# Altium project QUTMS_Shutdownboard_V2_1_Mezzanine.PrjPcb
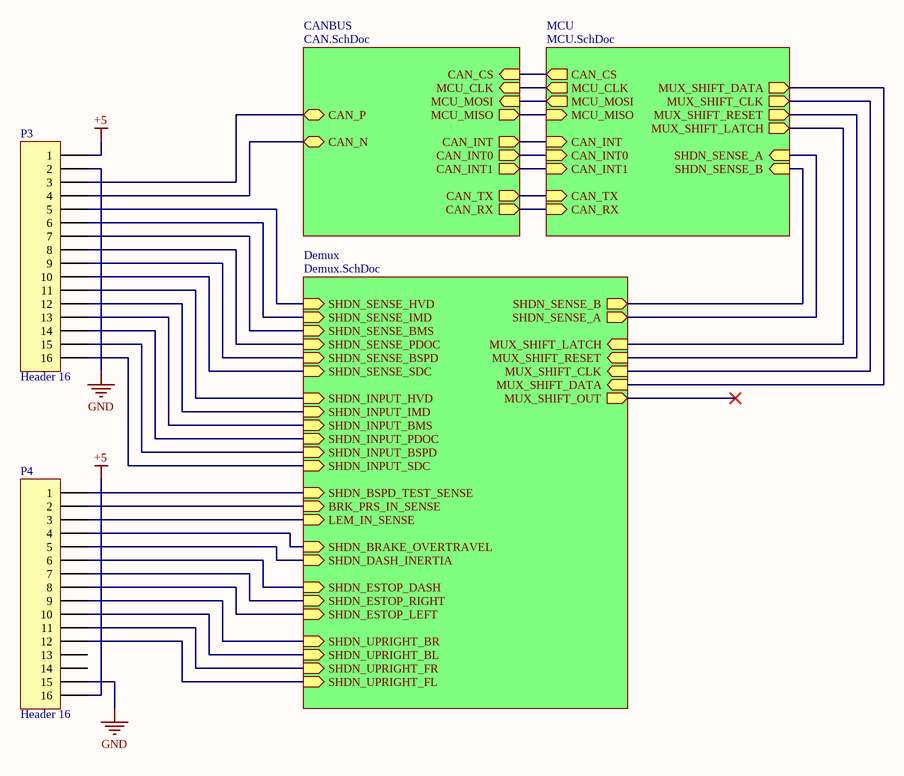
[diagram p0: Master.SchDoc]
4 sheets, 103 parts. Net scope: hierarchical (ports join the sheet entries above them; power ports are global).
Board file: DeutschPCB.PcbDoc
Sheets:
  Master.SchDoc
    MCU = MCU.SchDoc
    CANBUS = CAN.SchDoc
    Demux = Demux.SchDoc

## Sheet Master.SchDoc: QUTMS Shutdown Board V2.1 - Master Top
size A4; DocumentNumber: 1; Revision: 4; SheetNumber: 1; SheetTotal: 4

### Parts
P3  Header 16  [HDR1X16]
P4  Header 16  [HDR1X16]

### Sub-sheets
CANBUS = CAN.SchDoc: MCU_MOSI (in), MCU_CLK (in), CAN_CS (in), MCU_MISO (out), CAN_N (bidir), CAN_P (bidir), CAN_INT1 (out), CAN_INT0 (out), CAN_INT (out), CAN_TX (out), CAN_RX (out)
Demux = Demux.SchDoc: SHDN_ESTOP_DASH (in), SHDN_UPRIGHT_BL (in), SHDN_UPRIGHT_BR (in), SHDN_ESTOP_LEFT (in), SHDN_ESTOP_RIGHT (in), SHDN_DASH_INERTIA (in), SHDN_UPRIGHT_FR (in), SHDN_UPRIGHT_FL (in), SHDN_BRAKE_OVERTRAVEL (in), SHDN_BSPD_TEST_SENSE (in), BRK_PRS_IN_SENSE (in), LEM_IN_SENSE (in), SHDN_INPUT_HVD (in), SHDN_INPUT_IMD (in), SHDN_INPUT_BMS (in), SHDN_INPUT_PDOC (in), SHDN_INPUT_BSPD (in), SHDN_SENSE_HVD (in), SHDN_SENSE_IMD (in), SHDN_SENSE_BMS (in), SHDN_SENSE_PDOC (in), SHDN_SENSE_BSPD (in), SHDN_SENSE_A (out), MUX_SHIFT_OUT (out), SHDN_SENSE_B (out), MUX_SHIFT_LATCH (in), MUX_SHIFT_RESET (in), MUX_SHIFT_CLK (in), MUX_SHIFT_DATA (in), SHDN_INPUT_SDC (in), SHDN_SENSE_SDC (in)
MCU = MCU.SchDoc: MCU_MISO (in), MCU_MOSI (out), CAN_CS (out), MCU_CLK (out), CAN_INT (in), CAN_INT0 (in), CAN_INT1 (in), SHDN_SENSE_B (in), SHDN_SENSE_A (in), MUX_SHIFT_LATCH (out), MUX_SHIFT_RESET (out), MUX_SHIFT_CLK (out), MUX_SHIFT_DATA (out), CAN_RX (in), CAN_TX (in)

### Nets
+5: P3.1 P4.16
GND: P3.2 P4.15
CAN_CS: sheet MCU/CAN_CS, sheet CANBUS/CAN_CS
CAN_INT: sheet MCU/CAN_INT, sheet CANBUS/CAN_INT
CAN_INT0: sheet MCU/CAN_INT0, sheet CANBUS/CAN_INT0
CAN_INT1: sheet MCU/CAN_INT1, sheet CANBUS/CAN_INT1
CAN_N: P3.4 ; sheet CANBUS/CAN_N
CAN_P: P3.3 ; sheet CANBUS/CAN_P
CAN_RX: sheet MCU/CAN_RX, sheet CANBUS/CAN_RX
CAN_TX: sheet MCU/CAN_TX, sheet CANBUS/CAN_TX
MCU_CLK: sheet MCU/MCU_CLK, sheet CANBUS/MCU_CLK
MCU_MISO: sheet MCU/MCU_MISO, sheet CANBUS/MCU_MISO
MCU_MOSI: sheet MCU/MCU_MOSI, sheet CANBUS/MCU_MOSI
MUX_SHIFT_CLK: sheet MCU/MUX_SHIFT_CLK, sheet Demux/MUX_SHIFT_CLK
MUX_SHIFT_DATA: sheet MCU/MUX_SHIFT_DATA, sheet Demux/MUX_SHIFT_DATA
MUX_SHIFT_LATCH: sheet MCU/MUX_SHIFT_LATCH, sheet Demux/MUX_SHIFT_LATCH
MUX_SHIFT_RESET: sheet MCU/MUX_SHIFT_RESET, sheet Demux/MUX_SHIFT_RESET
SHDN_SENSE_A: sheet MCU/SHDN_SENSE_A, sheet Demux/SHDN_SENSE_A
SHDN_SENSE_B: sheet MCU/SHDN_SENSE_B, sheet Demux/SHDN_SENSE_B
NetP3_5: P3.5 ; sheet Demux/SHDN_SENSE_HVD
NetP3_6: P3.6 ; sheet Demux/SHDN_SENSE_IMD
NetP3_7: P3.7 ; sheet Demux/SHDN_SENSE_BMS
NetP3_8: P3.8 ; sheet Demux/SHDN_SENSE_PDOC
NetP3_9: P3.9 ; sheet Demux/SHDN_SENSE_BSPD
NetP3_10: P3.10 ; sheet Demux/SHDN_SENSE_SDC
NetP3_11: P3.11 ; sheet Demux/SHDN_INPUT_HVD
NetP3_12: P3.12 ; sheet Demux/SHDN_INPUT_IMD
NetP3_13: P3.13 ; sheet Demux/SHDN_INPUT_BMS
NetP3_14: P3.14 ; sheet Demux/SHDN_INPUT_PDOC
NetP3_15: P3.15 ; sheet Demux/SHDN_INPUT_BSPD
NetP3_16: P3.16 ; sheet Demux/SHDN_INPUT_SDC
NetP4_1: P4.1 ; sheet Demux/SHDN_BSPD_TEST_SENSE
NetP4_2: P4.2 ; sheet Demux/BRK_PRS_IN_SENSE
NetP4_3: P4.3 ; sheet Demux/LEM_IN_SENSE
NetP4_4: P4.4 ; sheet Demux/SHDN_BRAKE_OVERTRAVEL
NetP4_5: P4.5 ; sheet Demux/SHDN_DASH_INERTIA
NetP4_6: P4.6 ; sheet Demux/SHDN_ESTOP_DASH
NetP4_7: P4.7 ; sheet Demux/SHDN_ESTOP_RIGHT
NetP4_8: P4.8 ; sheet Demux/SHDN_ESTOP_LEFT
NetP4_9: P4.9 ; sheet Demux/SHDN_UPRIGHT_BR
NetP4_10: P4.10 ; sheet Demux/SHDN_UPRIGHT_BL
NetP4_11: P4.11 ; sheet Demux/SHDN_UPRIGHT_FR
NetP4_12: P4.12 ; sheet Demux/SHDN_UPRIGHT_FL

Not connected (* = marked no-connect by the designer): P4 13 14

### Notes on the sheet
- Title
- Size:
- A4
- Number:
- Revision:
- QUT Motorsport, O-120
- O Block, QUT Gardens Point
- Date:
- Time:
- Sheet
- of
- Brisbane, QLD, Australia

### Library data of the parts
P3 P4 = Header 16: Header, 16-Pin; LatestRevisionDate: 17-Jul-2002; LatestRevisionNote: Re-released for DXP Platform.; Publisher: Altium Limited

## Sheet MCU.SchDoc: QUTMS Shutdown V2.1 - MCU
size A4; Author: Jonn Dillon; Organization: QUT Motorsport; Address1: O-120; Address2: O Block; Address3: QUT Gardens Point; Address4: Brisbane, 4000; DocumentNumber: 2; Revision: 2; SheetNumber: 2; SheetTotal: 4
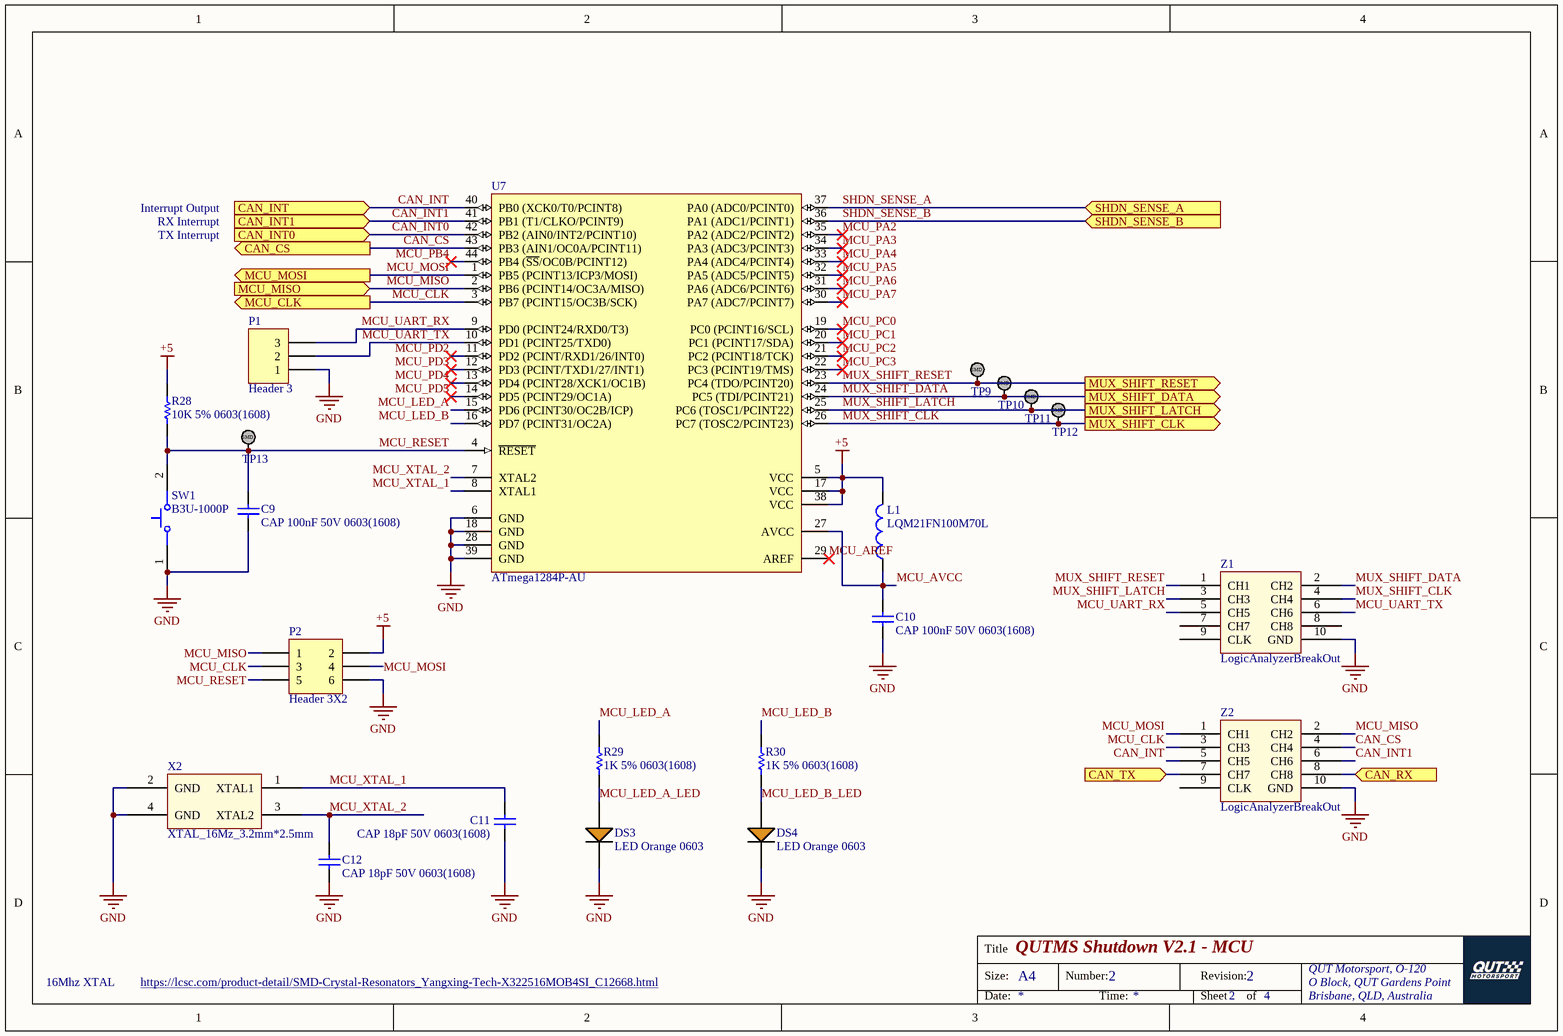
[diagram p1: MCU.SchDoc]

### Parts
C9  CAP 100nF 50V 0603(1608)  [CAPC0603(1608)100_L]
C10  CAP 100nF 50V 0603(1608)  [CAPC0603(1608)100_L]
C11  CAP 18pF 50V 0603(1608)  [CAPC0603(1608)100_L]
C12  CAP 18pF 50V 0603(1608)  [CAPC0603(1608)100_L]
DS3  LED Orange 0603  [LED ORANGE 0603]
DS4  LED Orange 0603  [LED ORANGE 0603]
L1  LQM21FN100M70L  [MURA-IND0805_L]
P1  Header 3  [HDR1X3]
P2  Header 3X2  [HDR2X3]
R28  10K 5% 0603(1608)  [RESC0603(1608)_N]
R29  1K 5% 0603(1608)  [RESC0603(1608)_L]
R30  1K 5% 0603(1608)  [RESC0603(1608)_L]
SW1  B3U-1000P  [OMRON-B3U-1000_V]
TP9  TestPoint_SMD  [TestPointSMD]  (value not drawn)
TP10  TestPoint_SMD  [TestPointSMD]  (value not drawn)
TP11  TestPoint_SMD  [TestPointSMD]  (value not drawn)
TP12  TestPoint_SMD  [TestPointSMD]  (value not drawn)
TP13  TestPoint_SMD  [TestPointSMD]  (value not drawn)
U7  ATmega1284P-AU  [44A_N]
X2  XTAL_16Mz_3.2mm*2.5mm  [3.2mm*2.5mm]
Z1  LogicAnalyzerBreakOut  [LogicAnalyzer]
Z2  LogicAnalyzerBreakOut  [LogicAnalyzer]

### Ports
CAN_CS (out), CAN_INT0 (in), CAN_INT1 (in), CAN_INT (in), CAN_RX (in), CAN_TX (in), MCU_CLK (out), MCU_MISO (in), MCU_MOSI (out), MUX_SHIFT_CLK (out), MUX_SHIFT_DATA (out), MUX_SHIFT_LATCH (out), MUX_SHIFT_RESET (out), SHDN_SENSE_A (in), SHDN_SENSE_B (in)

### Nets
+5: L1.2 P2.2 R28.2 U7.5(VCC) U7.17(VCC) U7.38(VCC)
GND: C9.2 C10.2 C11.1 C12.1 DS3.2(C) DS4.2(C) P1.1 P2.6 SW1.1 U7.6(GND) U7.18(GND) U7.28(GND) U7.39(GND) X2.2(GND) X2.4(GND) Z1.10(GND) Z2.10(GND)
CAN_CS: U7.43(PB3_(AIN1/OC0A/PCINT11)) Z2.4(CH4) ; port CAN_CS
CAN_INT: U7.40(PB0_(XCK0/T0/PCINT8)) Z2.5(CH5) ; port CAN_INT
CAN_INT0: U7.42(PB2_(AIN0/INT2/PCINT10)) ; port CAN_INT0
CAN_INT1: U7.41(PB1_(T1/CLKO/PCINT9)) Z2.6(CH6) ; port CAN_INT1
CAN_RX: Z2.8(CH8) ; port CAN_RX
CAN_TX: Z2.7(CH7) ; port CAN_TX
MCU_AREF: U7.29(AREF)
MCU_AVCC: C10.1 L1.1 U7.27(AVCC)
MCU_CLK: P2.3 U7.3(PB7_(PCINT15/OC3B/SCK)) Z2.3(CH3) ; port MCU_CLK
MCU_LED_A: R29.2 U7.15(PD6_(PCINT30/OC2B/ICP))
MCU_LED_A_LED: DS3.1(A) R29.1
MCU_LED_B: R30.2 U7.16(PD7_(PCINT31/OC2A))
MCU_LED_B_LED: DS4.1(A) R30.1
MCU_MISO: P2.1 U7.2(PB6_(PCINT14/OC3A/MISO)) Z2.2(CH2) ; port MCU_MISO
MCU_MOSI: P2.4 U7.1(PB5_(PCINT13/ICP3/MOSI)) Z2.1(CH1) ; port MCU_MOSI
MCU_PA2: U7.35(PA2_(ADC2/PCINT2))
MCU_PA3: U7.34(PA3_(ADC3/PCINT3))
MCU_PA4: U7.33(PA4_(ADC4/PCINT4))
MCU_PA5: U7.32(PA5_(ADC5/PCINT5))
MCU_PA6: U7.31(PA6_(ADC6/PCINT6))
MCU_PA7: U7.30(PA7_(ADC7/PCINT7))
MCU_PB4: U7.44(PB4_(~{SS}/OC0B/PCINT12))
MCU_PC0: U7.19(PC0_(PCINT16/SCL))
MCU_PC1: U7.20(PC1_(PCINT17/SDA))
MCU_PC2: U7.21(PC2_(PCINT18/TCK))
MCU_PC3: U7.22(PC3_(PCINT19/TMS))
MCU_PD2: U7.11(PD2_(PCINT/RXD1/26/INT0))
MCU_PD3: U7.12(PD3_(PCINT/TXD1/27/INT1))
MCU_PD4: U7.13(PD4_(PCINT28/XCK1/OC1B))
MCU_PD5: U7.14(PD5_(PCINT29/OC1A))
MCU_RESET: C9.1 P2.5 R28.1 SW1.2 TP13.1 U7.4(~{RESET})
MCU_UART_RX: P1.3 U7.9(PD0_(PCINT24/RXD0/T3)) Z1.5(CH5)
MCU_UART_TX: P1.2 U7.10(PD1_(PCINT25/TXD0)) Z1.6(CH6)
MCU_XTAL_1: C11.2 U7.8(XTAL1) X2.1(XTAL1)
MCU_XTAL_2: C12.2 U7.7(XTAL2) X2.3(XTAL2)
MUX_SHIFT_CLK: TP12.1 U7.26(PC7_(TOSC2/PCINT23)) Z1.4(CH4) ; port MUX_SHIFT_CLK
MUX_SHIFT_DATA: TP10.1 U7.24(PC5_(TDI/PCINT21)) Z1.2(CH2) ; port MUX_SHIFT_DATA
MUX_SHIFT_LATCH: TP11.1 U7.25(PC6_(TOSC1/PCINT22)) Z1.3(CH3) ; port MUX_SHIFT_LATCH
MUX_SHIFT_RESET: TP9.1 U7.23(PC4_(TDO/PCINT20)) Z1.1(CH1) ; port MUX_SHIFT_RESET
SHDN_SENSE_A: U7.37(PA0_(ADC0/PCINT0)) ; port SHDN_SENSE_A
SHDN_SENSE_B: U7.36(PA1_(ADC1/PCINT1)) ; port SHDN_SENSE_B

Not connected (* = marked no-connect by the designer): Z1 7(CH7) 8(CH8) 9(CLK); Z2 9(CLK)

### Notes on the sheet
- TX Interrupt
- RX Interrupt
- Interrupt Output
- 16Mhz XTAL
- https://lcsc.com/product-detail/SMD-Crystal-Resonators_Yangxing-Tech-X322516MOB4SI_C12668.html
- Title
- Size:
- A4
- Number:
- Revision:
- QUT Motorsport, O-120
- O Block, QUT Gardens Point
- Date:
- Time:
- Sheet
- of
- Brisbane, QLD, Australia
- (in symbol TestPoint_SMD) SMD

### Library data of the parts
C9 C10 = CMP-1035-02591-1: CAP 100nF 50V ±5% 0603 (1608 Metric) Thickness 1mm SMD; Tolerance: Â±5%; Case-Metric: 1608; Case-EIA: 0603; Rated Voltage: 50 V; Max Thickness: 1 mm; Technology: SMT; Value: 100nF
C11 C12 = CMP-1035-00748-1: CAP 18pF 50V ±1% 0603 (1608 Metric) Thickness 1mm SMD; Case-EIA: 0603; Case-Metric: 1608; Tolerance: Â±1%; Max Thickness: 1 mm; Value: 18pF; Rated Voltage: 50 V; Technology: SMT
L1 = CMP-2000-06587-1: Fixed Inductor, 10 uH, +/-20%, -55 to 125 degC, 2-Pin SMD (0805), RoHS, Tape and Reel; Manufacturer: Murata; Tolerance (%): 20%; DC Resistance: 0.6; Inductance-Nom: 10H; Rated Current-Max: 100mA; Package Reference: IND0805; Case Size/Dimension: 0805; Manufacturer URL: http://www.murata.com/; Package Description: 2-Pin Surface Mount Device, Body 2 x 1.25 mm; Datasheet URL: http://psearch.en.murata.com/inductor/product/LQM21FN100M70%23.pdf; Mounting Technology: SurfaceMount; Datasheet Version: 05/2016
P1 = Header 3: Header, 3-Pin; LatestRevisionDate: 17-Jul-2002; LatestRevisionNote: Re-released for DXP Platform.; Publisher: Altium Limited
P2 = Header 3X2: Header, 3-Pin, Dual row; LatestRevisionDate: 17-Jul-2002; LatestRevisionNote: Re-released for DXP Platform.; Publisher: Altium Limited
R28 = CMP-1012-00098-1: 10K 0.1W 5% 0603 (1608 Metric)  SMD; Case-EIA: 0603; Value: 10000.00 Ohm; Case-Metric: 1608; Technology: SMT; Tolerance: 5 %; Power: 0.1 W
R29 R30 = CMP-1012-00074-1: 1K 0.1W 5% 0603 (1608 Metric)  SMD; Case-EIA: 0603; Case-Metric: 1608; Value: 1000.00 Ohm; Technology: SMT; Tolerance: 5 %; Power: 0.1 W
SW1 = CMP-2100-03586-1: Ultra-Small Tactile Switch, 0.05 A, 12 V, -25 to 70 degC, 2-Pin SMD, RoHS, Tape and Reel; Manufacturer: Omron Electronic Components; Operating Force: 1.5N; Current Rating: 50mA; Voltage Rating (DC): 12V; Electrical Life: 200000Cycles; Actuator Length: 0.4mm; Insulation Resistance: 100MOhm; Switch Travel: 0.15mm; Throw Configuration: SPST; Illumination Type: Illuminated; Width: 3mm; Weight: 0.022g; Datasheet Version: 42005.0; Datasheet URL: http://www.omron.com/ecb/products/pdf/en-b3u.pdf; Height: 1.2mm; Package Quantity: 1; REACH SVHC: Unknown; Contact Current Rating: 50mA; Contact Material: Silver; Max Current Rating: 50mA; Package Reference: B3U-1000; Termination: SMD/SMT; Packaging: TapeandReel; Manufacturer URL: http://www.omron.com/; RoHSCompliant: true; Mount: SurfaceMount; Length: 4mm; Min Operating Temperature: -25degC; Depth: 2.5mm; Lead Free: LeadFree; Case/Package: SMD/SMT; Package Description: 2-Pin Surface Mount Device, Body 3 x 2.5 mm; Max Operating Temperature: 70degC; Orientation: Straight
U7 = CMP-0095-00577-1: 8-bit AVR Microcontroller, 128KB Flash, 4KB EEPROM, 16KB SRAM, 44-pin TQFP, Industrial Grade (-40°C to 85°C); PackageReference: 44A; Code_JEDEC: MS-026-ACB; ComponentLink3Description: ATmega164A/164PA/324A/324PA/644A/644PA/1284/1284P Summary; DatasheetVersion: revC, Jun-2011; PackageDescription: 44-Pin Plastic Thin Profile Quad Flat Pack, 10 x 10 x 1.0 mm Body, 0.8 mm Pitch (TQFP); ComponentLink3URL: http://www.atmel.com/dyn/resources/prod_documents/8272S.pdf; ComponentLink1URL: http://www.atmel.com/; ComponentLink1Description: Manufacturer URL; ComponentLink2Description: ATmega164A/164PA/324A/324PA/644A/644PA/1284/1284P Datasheet; ComponentLink2URL: http://www.atmel.com/dyn/resources/prod_documents/doc8272.pdf; PackageVersion: revC, Oct-2010
Z1 Z2 = LogicAnalyer
  Z1: ComponentLink1Description: LCSC; ComponentLink1URL: https://lcsc.com/product-detail/IDC-Connectors_BOOMELE-Boom-Precision-Elec-C5665_C5665.html
X2 = XTAL_16Mz_3.2mm*2.5mm: ComponentLink1Description: LCSC; ComponentLink1URL: https://lcsc.com/product-detail/SMD-Crystal-Resonators_Yangxing-Tech-X322516MOB4SI_C12668.html

## Sheet CAN.SchDoc: QUTMS Shutdown V2.1 - CANBUS
size A4; Author: Jonn Dillon; Organization: QUT Motorsport; Address1: O-120; Address2: O Block; Address3: QUT Gardens Point; Address4: Brisbane, 4000; DocumentNumber: 3; Revision: 4; SheetNumber: 3; SheetTotal: 4
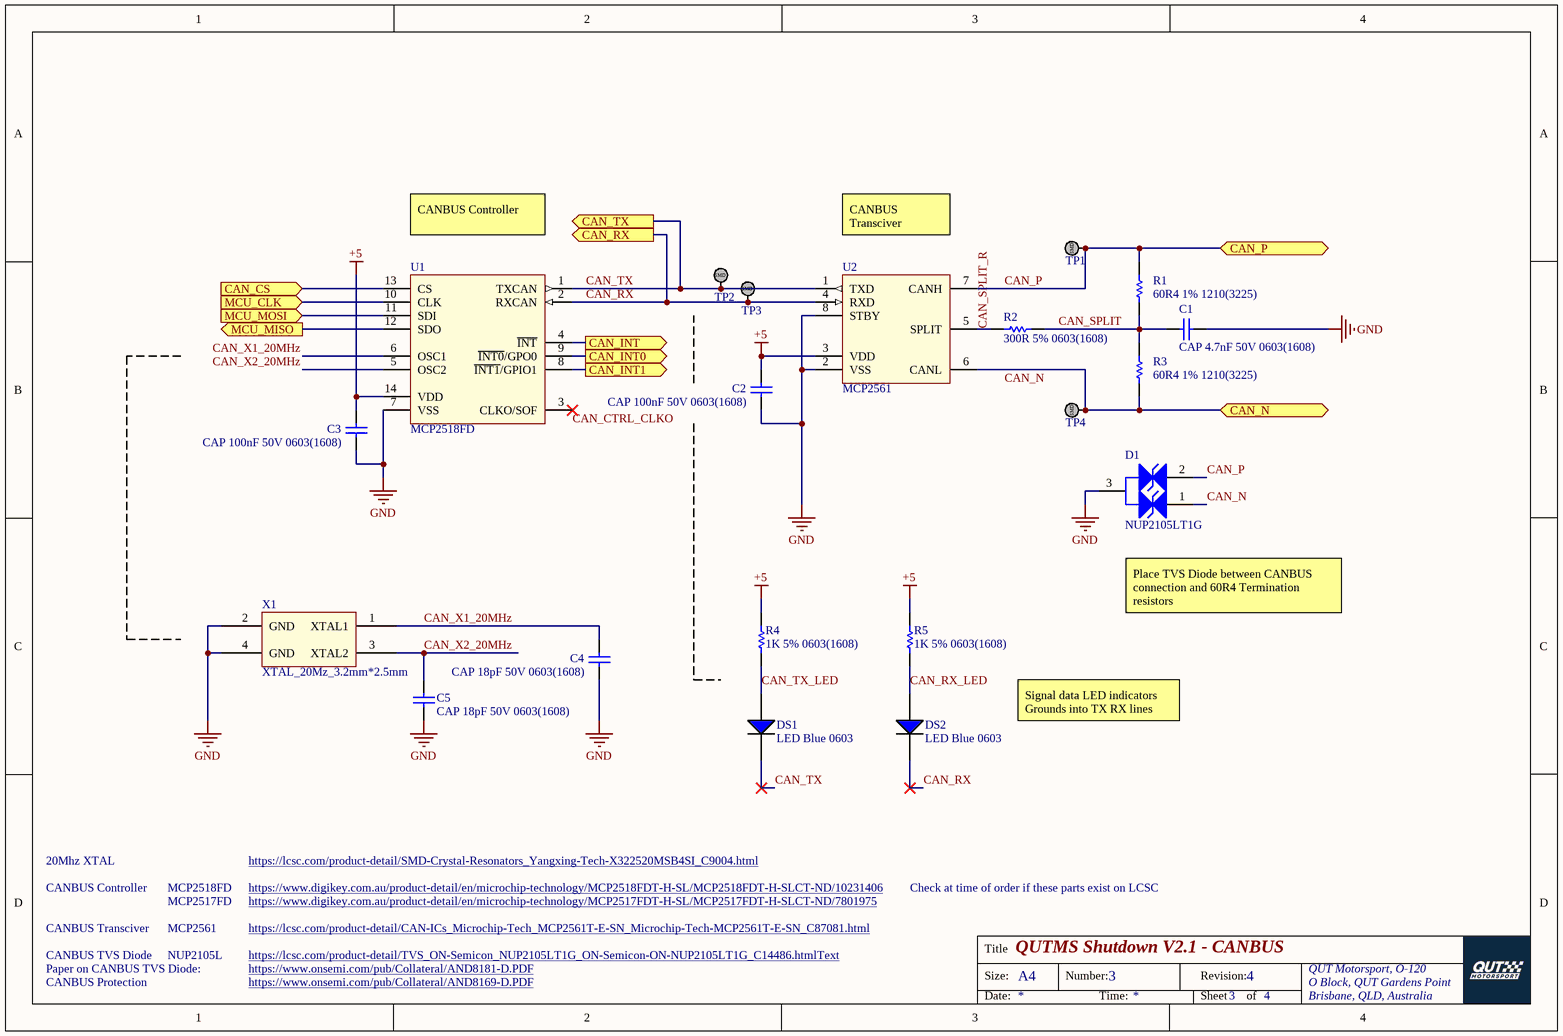
[diagram p2: CAN.SchDoc]

### Parts
C1  CAP 4.7nF 50V 0603(1608)  [CAPC0603(1608)100_M]
C2  CAP 100nF 50V 0603(1608)  [CAPC0603(1608)100_L]
C3  CAP 100nF 50V 0603(1608)  [CAPC0603(1608)100_L]
C4  CAP 18pF 50V 0603(1608)  [CAPC0603(1608)100_L]
C5  CAP 18pF 50V 0603(1608)  [CAPC0603(1608)100_L]
D1  NUP2105LT1G  [ONSC-SOT-23-3-318-08_V]
DS1  LED Blue 0603  [LED BLUE 0603]
DS2  LED Blue 0603  [LED BLUE 0603]
R1  60R4 1% 1210(3225)  [RESC1210(3225)_L]
R2  300R 5% 0603(1608)  [RESC0603(1608)_N]
R3  60R4 1% 1210(3225)  [RESC1210(3225)_L]
R4  1K 5% 0603(1608)  [RESC0603(1608)_L]
R5  1K 5% 0603(1608)  [RESC0603(1608)_L]
TP1  TestPoint_SMD  [TestPointSMD]  (value not drawn)
TP2  TestPoint_SMD  [TestPointSMD]  (value not drawn)
TP3  TestPoint_SMD  [TestPointSMD]  (value not drawn)
TP4  TestPoint_SMD  [TestPointSMD]  (value not drawn)
U1  MCP2518FD  [MCP2517FD SOIC]
U2  MCP2561  [MCP2561 SOIC]
X1  XTAL_20Mz_3.2mm*2.5mm  [3.2mm*2.5mm]

### Ports
CAN_CS (in), CAN_INT0 (out), CAN_INT1 (out), CAN_INT (out), CAN_N (bidir), CAN_P (bidir), CAN_RX (out), CAN_TX (out), MCU_CLK (in), MCU_MISO (out), MCU_MOSI (in)

### Nets
+5: C2.2 C3.2 R4.2 R5.2 U1.14(VDD) U2.3(VDD)
GND: C1.1 C2.1 C3.1 C4.1 C5.1 D1.3(K) U1.7(VSS) U2.2(VSS) U2.8(STBY) X1.2(GND) X1.4(GND)
CAN_CS: U1.13(CS) ; port CAN_CS
CAN_CTRL_CLKO: U1.3(CLKO/SOF)
CAN_INT: U1.4(~{INT}) ; port CAN_INT
CAN_INT0: U1.9(~{INT0}/GPO0) ; port CAN_INT0
CAN_INT1: U1.8(~{INT1}/GPIO1) ; port CAN_INT1
CAN_N: D1.1(K) R3.1 TP4.1 U2.6(CANL) ; port CAN_N
CAN_P: D1.2(K) R1.2 TP1.1 U2.7(CANH) ; port CAN_P
CAN_RX: DS2.2(C) TP3.1 U1.2(RXCAN) U2.4(RXD) ; port CAN_RX
CAN_RX_LED: DS2.1(A) R5.1
CAN_SPLIT: C1.2 R1.1 R2.2 R3.2
CAN_SPLIT_R: R2.1 U2.5(SPLIT)
CAN_TX: DS1.2(C) TP2.1 U1.1(TXCAN) U2.1(TXD) ; port CAN_TX
CAN_TX_LED: DS1.1(A) R4.1
CAN_X1_20MHz: C4.2 U1.6(OSC1) X1.1(XTAL1)
CAN_X2_20MHz: C5.2 U1.5(OSC2) X1.3(XTAL2)
MCU_CLK: U1.10(CLK) ; port MCU_CLK
MCU_MISO: U1.12(SDO) ; port MCU_MISO
MCU_MOSI: U1.11(SDI) ; port MCU_MOSI

### Notes on the sheet
- CANBUS Controller
- CANBUS Transciver
- Place TVS Diode between CANBUS connection and 60R4 Termination resistors
- Signal data LED indicators
  Grounds into TX RX lines
- 20Mhz XTAL
- MCP2518FD
- MCP2517FD
- https://www.digikey.com.au/product-detail/en/microchip-technology/MCP2518FDT-H-SL/MCP2518FDT-H-SLCT-ND/10231406
- https://www.digikey.com.au/product-detail/en/microchip-technology/MCP2517FDT-H-SL/MCP2517FDT-H-SLCT-ND/7801975
- https://lcsc.com/product-detail/SMD-Crystal-Resonators_Yangxing-Tech-X322520MSB4SI_C9004.html
- Check at time of order if these parts exist on LCSC
- Paper on CANBUS TVS Diode:
- CANBUS TVS Diode
- CANBUS Protection
- MCP2561
- NUP2105L
- https://www.onsemi.com/pub/Collateral/AND8181-D.PDF
- https://lcsc.com/product-detail/CAN-ICs_Microchip-Tech_MCP2561T-E-SN_Microchip-Tech-MCP2561T-E-SN_C87081.html
- https://lcsc.com/product-detail/TVS_ON-Semicon_NUP2105LT1G_ON-Semicon-ON-NUP2105LT1G_C14486.htmlText
- https://www.onsemi.com/pub/Collateral/AND8169-D.PDF
- Title
- Size:
- A4
- Number:
- Revision:
- QUT Motorsport, O-120
- O Block, QUT Gardens Point
- Date:
- Time:
- Sheet
- of
- Brisbane, QLD, Australia
- (in symbol TestPoint_SMD) SMD

### Library data of the parts
C1 = CMP-1035-02202-1: CAP 4.7nF 50V ±5% 0603 (1608 Metric) Thickness 1mm SMD; Case-Metric: 1608; Case-EIA: 0603; Tolerance: Â±5%; Value: 4.7nF; Rated Voltage: 50 V; Technology: SMT; Max Thickness: 1 mm
C2 C3 = CMP-1035-02591-1: as C9 on sheet MCU; Rated Voltage: 50 V; Max Thickness: 1 mm; Technology: SMT; Value: 100nF
C4 C5 = CMP-1035-00748-1: as C11 on sheet MCU; Max Thickness: 1 mm; Value: 18pF; Rated Voltage: 50 V; Technology: SMT
D1 = CMP-1063-00164-1: Dual Line CAN Bus Protector, 3-Pin SOT-23, Pb-Free, Tape and Reel; Manufacturer: On Semiconductor; IR Max (uA): 0.1; Number of Lines: 2; Direction: Bidirectional; C Max (pF): 30; PPK Max (W): 350; V(BR) Min (V): 26.2; ComponentLink3URL: http://www.onsemi.cn/pub_link/Collateral/318-08.PDF; Mounting Technology: Surface Mount; ComponentLink2Description: Datasheet; PartNumber: NUP2105LT1G; ComponentLink1URL: http://www.onsemi.com/; PackageVersion: Rev. AP, 11/2009; DatasheetVersion: Rev. 5; RoHS: Pb-Free; PackageReference: SOT-23-3-318-08; ComponentLink2URL: http://www.onsemi.cn/pub_link/Collateral/NUP2105L-D.PDF; ComponentLink1Description: Manufacturer URL; PackageDescription: 3-Pin Small Outline Transistor, Body 2.92 x 1.3 mm, Pitch 0.95 mm; Packing: Tape and Reel; ComponentLink3Description: Package Specification
R1 R3 = CMP-1015-00372-1: 60R4 0.5W 1% 1210 (3225 Metric)  SMD; Case-Metric: 3225; Case-EIA: 1210; Value: 60.40 Ohm; Technology: SMT; Tolerance: 1 %; Power: 0.5 W
R2 = CMP-1012-00061-1: 300R 0.1W 5% 0603 (1608 Metric)  SMD; Case-EIA: 0603; Value: 300.00 Ohm; Case-Metric: 1608; Tolerance: 5 %; Power: 0.1 W; Technology: SMT
R4 R5 = CMP-1012-00074-1: as R29 on sheet MCU; Technology: SMT; Tolerance: 5 %; Power: 0.1 W
X1 = XTAL_20Mz_3.2mm*2.5mm: ComponentLink1Description: LCSC; ComponentLink1URL: https://lcsc.com/product-detail/SMD-Crystal-Resonators_Yangxing-Tech-X322520MSB4SI_C9004.html

## Sheet Demux.SchDoc: QUTMS Shutdown V2.1 - Demux
size A3; Organization: QUT Motorsport; Address1: O-120; Address2: O Block; Address3: QUT Gardnes Point; Address4: Brisbane, 4000; DocumentNumber: 4; Revision: 6; SheetNumber: 4; SheetTotal: 4
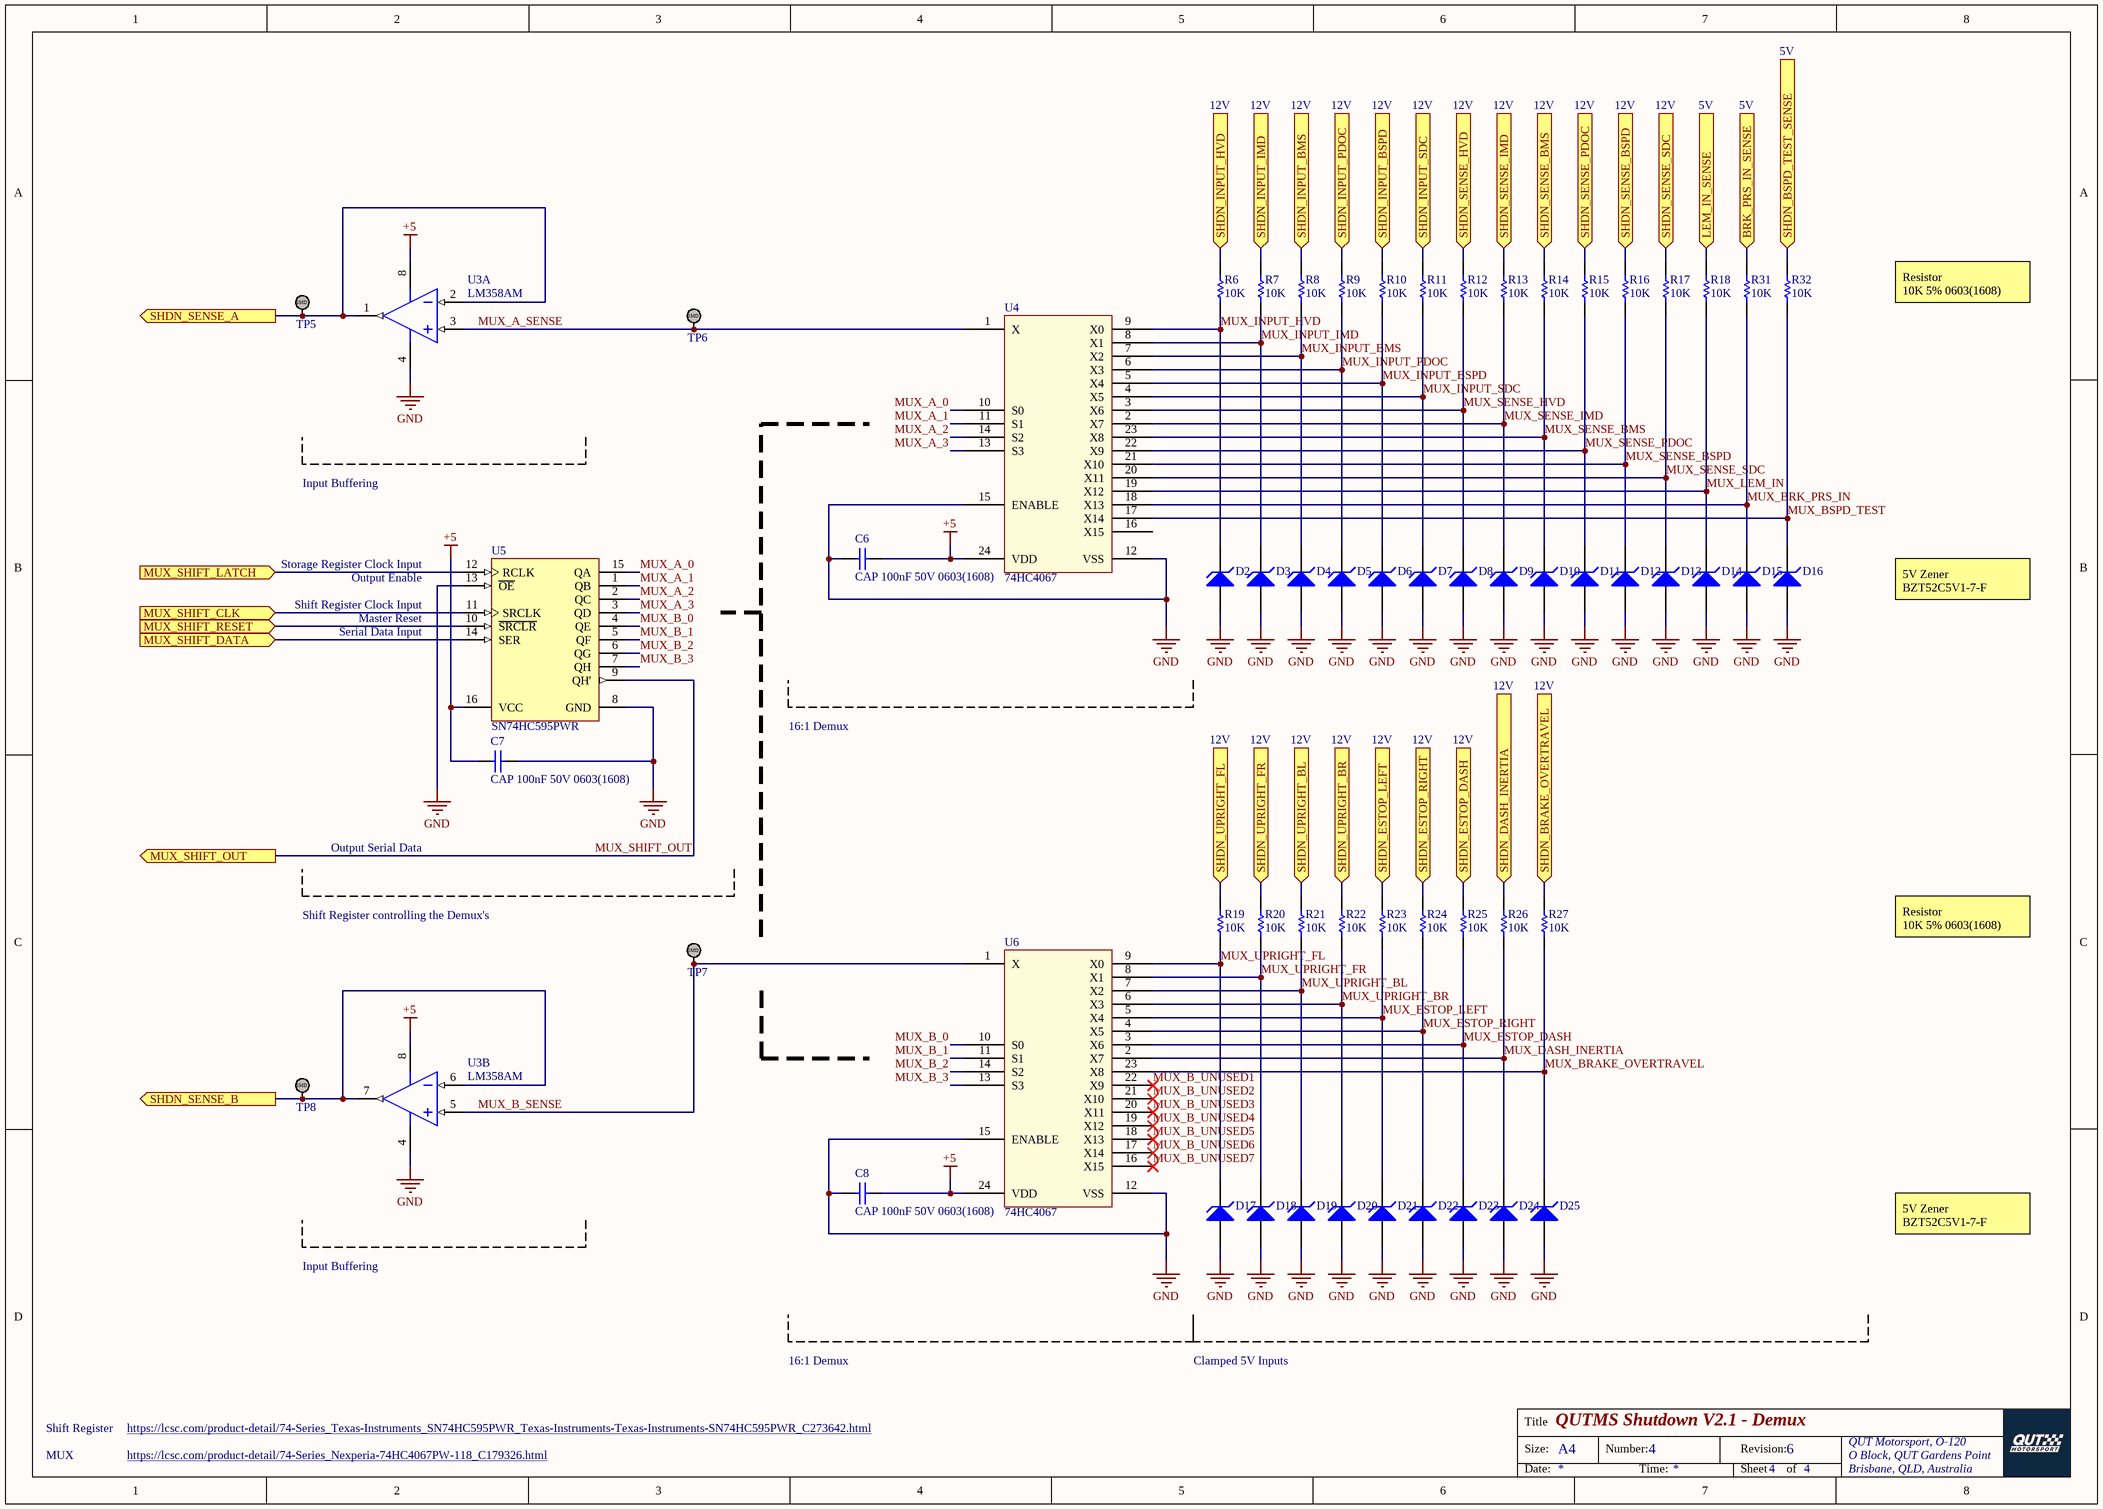
[diagram p3: Demux.SchDoc]

### Parts
C6  CAP 100nF 50V 0603(1608)  [CAPC0603(1608)100_L]
C7  CAP 100nF 50V 0603(1608)  [CAPC0603(1608)100_L]
C8  CAP 100nF 50V 0603(1608)  [CAPC0603(1608)100_L]
D2  BZT52C5V1-7-F  [DIOD-SOD123_V]  (value not drawn)
D3  BZT52C5V1-7-F  [DIOD-SOD123_V]  (value not drawn)
D4  BZT52C5V1-7-F  [DIOD-SOD123_V]  (value not drawn)
D5  BZT52C5V1-7-F  [DIOD-SOD123_V]  (value not drawn)
D6  BZT52C5V1-7-F  [DIOD-SOD123_V]  (value not drawn)
D7  BZT52C5V1-7-F  [DIOD-SOD123_V]  (value not drawn)
D8  BZT52C5V1-7-F  [DIOD-SOD123_V]  (value not drawn)
D9  BZT52C5V1-7-F  [DIOD-SOD123_V]  (value not drawn)
D10  BZT52C5V1-7-F  [DIOD-SOD123_V]  (value not drawn)
D11  BZT52C5V1-7-F  [DIOD-SOD123_V]  (value not drawn)
D12  BZT52C5V1-7-F  [DIOD-SOD123_V]  (value not drawn)
D13  BZT52C5V1-7-F  [DIOD-SOD123_V]  (value not drawn)
D14  BZT52C5V1-7-F  [DIOD-SOD123_V]  (value not drawn)
D15  BZT52C5V1-7-F  [DIOD-SOD123_V]  (value not drawn)
D16  BZT52C5V1-7-F  [DIOD-SOD123_V]  (value not drawn)
D17  BZT52C5V1-7-F  [DIOD-SOD123_V]  (value not drawn)
D18  BZT52C5V1-7-F  [DIOD-SOD123_V]  (value not drawn)
D19  BZT52C5V1-7-F  [DIOD-SOD123_V]  (value not drawn)
D20  BZT52C5V1-7-F  [DIOD-SOD123_V]  (value not drawn)
D21  BZT52C5V1-7-F  [DIOD-SOD123_V]  (value not drawn)
D22  BZT52C5V1-7-F  [DIOD-SOD123_V]  (value not drawn)
D23  BZT52C5V1-7-F  [DIOD-SOD123_V]  (value not drawn)
D24  BZT52C5V1-7-F  [DIOD-SOD123_V]  (value not drawn)
D25  BZT52C5V1-7-F  [DIOD-SOD123_V]  (value not drawn)
R6  10K  [RESC0603(1608)_N]
R7  10K  [RESC0603(1608)_N]
R8  10K  [RESC0603(1608)_N]
R9  10K  [RESC0603(1608)_N]
R10  10K  [RESC0603(1608)_N]
R11  10K  [RESC0603(1608)_N]
R12  10K  [RESC0603(1608)_N]
R13  10K  [RESC0603(1608)_N]
R14  10K  [RESC0603(1608)_N]
R15  10K  [RESC0603(1608)_N]
R16  10K  [RESC0603(1608)_N]
R17  10K  [RESC0603(1608)_N]
R18  10K  [RESC0603(1608)_N]
R19  10K  [RESC0603(1608)_N]
R20  10K  [RESC0603(1608)_N]
R21  10K  [RESC0603(1608)_N]
R22  10K  [RESC0603(1608)_N]
R23  10K  [RESC0603(1608)_N]
R24  10K  [RESC0603(1608)_N]
R25  10K  [RESC0603(1608)_N]
R26  10K  [RESC0603(1608)_N]
R27  10K  [RESC0603(1608)_N]
R31  10K  [RESC0603(1608)_N]
R32  10K  [RESC0603(1608)_N]
TP5  TestPoint_SMD  [TestPointSMD]  (value not drawn)
TP6  TestPoint_SMD  [TestPointSMD]  (value not drawn)
TP7  TestPoint_SMD  [TestPointSMD]  (value not drawn)
TP8  TestPoint_SMD  [TestPointSMD]  (value not drawn)
U3  LM358AM  [D0008A_M]  (parts A,B of 2)
U4  74HC4067  [74HC4067 TSSOP24]
U5  SN74HC595PWR  [PW0016A_L]
U6  74HC4067  [74HC4067 TSSOP24]

### Ports
BRK_PRS_IN_SENSE (in), LEM_IN_SENSE (in), MUX_SHIFT_CLK (in), MUX_SHIFT_DATA (in), MUX_SHIFT_LATCH (in), MUX_SHIFT_OUT (out), MUX_SHIFT_RESET (in), SHDN_BRAKE_OVERTRAVEL (in), SHDN_BSPD_TEST_SENSE (in), SHDN_DASH_INERTIA (in), SHDN_ESTOP_DASH (in), SHDN_ESTOP_LEFT (in), SHDN_ESTOP_RIGHT (in), SHDN_INPUT_BMS (in), SHDN_INPUT_BSPD (in), SHDN_INPUT_HVD (in), SHDN_INPUT_IMD (in), SHDN_INPUT_PDOC (in), SHDN_INPUT_SDC (in), SHDN_SENSE_A (out), SHDN_SENSE_B (out), SHDN_SENSE_BMS (in), SHDN_SENSE_BSPD (in), SHDN_SENSE_HVD (in), SHDN_SENSE_IMD (in), SHDN_SENSE_PDOC (in), SHDN_SENSE_SDC (in), SHDN_UPRIGHT_BL (in), SHDN_UPRIGHT_BR (in), SHDN_UPRIGHT_FL (in), SHDN_UPRIGHT_FR (in)

### Nets
+5: C6.1 C7.2 C8.1 U3.8(V+) U4.24(VDD) U5.16(VCC) U6.24(VDD)
GND: C6.2 C7.1 C8.2 D2.1(A) D3.1(A) D4.1(A) D5.1(A) D6.1(A) D7.1(A) D8.1(A) D9.1(A) D10.1(A) D11.1(A) D12.1(A) D13.1(A) D14.1(A) D15.1(A) D16.1(A) D17.1(A) D18.1(A) D19.1(A) D20.1(A) D21.1(A) D22.1(A) D23.1(A) D24.1(A) D25.1(A) U3.4(GND) U4.12(VSS) U4.15(ENABLE) U5.8(GND) U5.13(~{OE}) U6.12(VSS) U6.15(ENABLE)
MUX_A_0: U4.10(S0) U5.15(QA)
MUX_A_1: U4.11(S1) U5.1(QB)
MUX_A_2: U4.14(S2) U5.2(QC)
MUX_A_3: U4.13(S3) U5.3(QD)
MUX_A_SENSE: TP6.1 U3.3(INA+) U4.1(X)
MUX_B_0: U5.4(QE) U6.10(S0)
MUX_B_1: U5.5(QF) U6.11(S1)
MUX_B_2: U5.6(QG) U6.14(S2)
MUX_B_3: U5.7(QH) U6.13(S3)
MUX_B_SENSE: TP7.1 U3.5(INB+) U6.1(X)
MUX_B_UNUSED1: U6.22(X9)
MUX_B_UNUSED2: U6.21(X10)
MUX_B_UNUSED3: U6.20(X11)
MUX_B_UNUSED4: U6.19(X12)
MUX_B_UNUSED5: U6.18(X13)
MUX_B_UNUSED6: U6.17(X14)
MUX_B_UNUSED7: U6.16(X15)
MUX_BRAKE_OVERTRAVEL: D25.2(K) R27.2 U6.23(X8)
MUX_BRK_PRS_IN: D15.2(K) R31.2 U4.18(X13)
MUX_BSPD_TEST: D16.2(K) R32.2 U4.17(X14)
MUX_DASH_INERTIA: D24.2(K) R26.2 U6.2(X7)
MUX_ESTOP_DASH: D23.2(K) R25.2 U6.3(X6)
MUX_ESTOP_LEFT: D21.2(K) R23.2 U6.5(X4)
MUX_ESTOP_RIGHT: D22.2(K) R24.2 U6.4(X5)
MUX_INPUT_BMS: D4.2(K) R8.2 U4.7(X2)
MUX_INPUT_BSPD: D6.2(K) R10.2 U4.5(X4)
MUX_INPUT_HVD: D2.2(K) R6.2 U4.9(X0)
MUX_INPUT_IMD: D3.2(K) R7.2 U4.8(X1)
MUX_INPUT_PDOC: D5.2(K) R9.2 U4.6(X3)
MUX_INPUT_SDC: D7.2(K) R11.2 U4.4(X5)
MUX_LEM_IN: D14.2(K) R18.2 U4.19(X12)
MUX_SENSE_BMS: D10.2(K) R14.2 U4.23(X8)
MUX_SENSE_BSPD: D12.2(K) R16.2 U4.21(X10)
MUX_SENSE_HVD: D8.2(K) R12.2 U4.3(X6)
MUX_SENSE_IMD: D9.2(K) R13.2 U4.2(X7)
MUX_SENSE_PDOC: D11.2(K) R15.2 U4.22(X9)
MUX_SENSE_SDC: D13.2(K) R17.2 U4.20(X11)
MUX_SHIFT_CLK: U5.11(SRCLK) ; port MUX_SHIFT_CLK
MUX_SHIFT_DATA: U5.14(SER) ; port MUX_SHIFT_DATA
MUX_SHIFT_LATCH: U5.12(RCLK) ; port MUX_SHIFT_LATCH
MUX_SHIFT_OUT: U5.9(QH') ; port MUX_SHIFT_OUT
MUX_SHIFT_RESET: U5.10(~{SRCLR}) ; port MUX_SHIFT_RESET
MUX_UPRIGHT_BL: D19.2(K) R21.2 U6.7(X2)
MUX_UPRIGHT_BR: D20.2(K) R22.2 U6.6(X3)
MUX_UPRIGHT_FL: D17.2(K) R19.2 U6.9(X0)
MUX_UPRIGHT_FR: D18.2(K) R20.2 U6.8(X1)
SHDN_SENSE_A: TP5.1 U3.1(OUTA) U3.2(INA-) ; port SHDN_SENSE_A
SHDN_SENSE_B: TP8.1 U3.6(INB-) U3.7(OUTB) ; port SHDN_SENSE_B
NetP3_5: R12.1 ; port SHDN_SENSE_HVD
NetP3_6: R13.1 ; port SHDN_SENSE_IMD
NetP3_7: R14.1 ; port SHDN_SENSE_BMS
NetP3_8: R15.1 ; port SHDN_SENSE_PDOC
NetP3_9: R16.1 ; port SHDN_SENSE_BSPD
NetP3_10: R17.1 ; port SHDN_SENSE_SDC
NetP3_11: R6.1 ; port SHDN_INPUT_HVD
NetP3_12: R7.1 ; port SHDN_INPUT_IMD
NetP3_13: R8.1 ; port SHDN_INPUT_BMS
NetP3_14: R9.1 ; port SHDN_INPUT_PDOC
NetP3_15: R10.1 ; port SHDN_INPUT_BSPD
NetP3_16: R11.1 ; port SHDN_INPUT_SDC
NetP4_1: R32.1 ; port SHDN_BSPD_TEST_SENSE
NetP4_2: R31.1 ; port BRK_PRS_IN_SENSE
NetP4_3: R18.1 ; port LEM_IN_SENSE
NetP4_4: R27.1 ; port SHDN_BRAKE_OVERTRAVEL
NetP4_5: R26.1 ; port SHDN_DASH_INERTIA
NetP4_6: R25.1 ; port SHDN_ESTOP_DASH
NetP4_7: R24.1 ; port SHDN_ESTOP_RIGHT
NetP4_8: R23.1 ; port SHDN_ESTOP_LEFT
NetP4_9: R22.1 ; port SHDN_UPRIGHT_BR
NetP4_10: R21.1 ; port SHDN_UPRIGHT_BL
NetP4_11: R20.1 ; port SHDN_UPRIGHT_FR
NetP4_12: R19.1 ; port SHDN_UPRIGHT_FL

Not connected (* = marked no-connect by the designer): U4 16(X15)

### Notes on the sheet
- 12V
- 5V
- Resistor
  10K 5% 0603(1608)
- Input Buffering
- Output Enable
- Storage Register Clock Input
- Serial Data Input
- Master Reset
- Shift Register Clock Input
- 5V Zener
  BZT52C5V1-7-F
- 16:1 Demux
- Output Serial Data
- Shift Register controlling the Demux's
- Clamped 5V Inputs
- MUX
- Shift Register
- https://lcsc.com/product-detail/74-Series_Nexperia-74HC4067PW-118_C179326.html
- https://lcsc.com/product-detail/74-Series_Texas-Instruments_SN74HC595PWR_Texas-Instruments-Texas-Instruments-SN74HC595PWR_C273642.html
- Title
- Size:
- A4
- Number:
- Revision:
- QUT Motorsport, O-120
- O Block, QUT Gardens Point
- Date:
- Time:
- Sheet
- of
- Brisbane, QLD, Australia
- (in symbol TestPoint_SMD) SMD

### Library data of the parts
C6-C8 = CMP-1035-02591-1: as C9 on sheet MCU; Rated Voltage: 50 V; Max Thickness: 1 mm; Technology: SMT; Value: 100nF
D2-D25 = CMP-2000-05976-1: Surface Mount Zener Diode, 5.1 V, -65 to 150 degC, 2-Pin SMD (SOD-123), RoHS, Tape and Reel; Manufacturer: DiodesIncorporated; Unit Weight: 0.000353oz; Zz - Zener Impedance: 60Ohms; Vz - Zener Voltage: 5.1V; Pd - Power Dissipation: 500mW; Zener Current: 5mA; Ir - Reverse Current: 2uA; Voltage Temperature Coefficient: -0.75mV/C; Configuration: Single; Voltage Tolerance: 6%; Height: 1.35mm; Width: 1.7mm; Minimum Operating Temperature: -65C; Series: BZT52C5; Package Description: 2-Pin Surface Mount Device, Body 2.7 x 1.55 mm; Length: 2.85mm; Mounting Technology: SurfaceMount; Brand: DiodesIncorporated; Factory Pack Quantity: 3000; Product Category: ZenerDiodes; RoHS: True; Manufacturer URL: http://www.diodes.com/; Termination Style: SMD/SMT; Package / Case: SOD-123; Packaging: Reel; Package Reference: SOD123; Datasheet Version: Rev. 37-2, 09/2012; Maximum Operating Temperature: +150C; Datasheet URL: http://www.diodes.com/_files/datasheets/ds18004.pdf; Mounting Style: SMD/SMT
R6-R27 R31 R32 = CMP-1012-00098-1: as R28 on sheet MCU; Technology: SMT; Tolerance: 5 %; Power: 0.1 W
U3 = CMP-0055-00796-3: Low Power Dual Operational Amplifier, 8-pin Narrow SOIC; Manufacturer: Texas Instruments; CompType: Amplifiers; PackageTopMarking: NSZXTT*LM*358AM; PowerWise: N; Code_JEDEC: MS-012-AA; RoHS: N; PinCount: 8; Package Reference: D0008A; ComponentLink1Description: Datasheet URL; ComponentLink1URL: http://www.ti.com/general/docs/lit/getliterature.tsp?genericPartNumber=LM358-N&fileType=pdf; Code_IPC: SOIC127P600-8; PackageDescription: SOIC Narrow, 4.9 x 3.9 x 1.45mm, 8 Lead, 1.27mm Pitch
U5 = CMP-0780-00192-3: 8-Bit Shift Registers With 3-State Output Registers, PW0016A, LARGE T&R; Manufacturer: Texas Instruments; VCC(Max)(V): 6; Bits: 8; Output Type: CMOS; 3-State Output: Yes; Output Drive (IOL/IOH)(Max)(mA): 7.8/-7.8; VCC(Min)(V): 2; Rating: Military; tpd @ Nom Voltage(Max)(ns): 34; ICC @ Nom Voltage(Max)(mA): 0.08; Technology Family: HC; F @ Nom Voltage(Max)(Mhz): 28; PackageReference: PW0016A; Generic Part Number: SN74HC595; Operating Temperature Range(C): -40 to 85; PackageVersion: http://www.ti.com/lit/ml/mpds361/mpds361.pdf; Code_JEDEC: MO-153; DatasheetVersion: SCLS041H; Voltage(Nom)(V): 6; Input Type: CMOS

## Nets that join several sheets
+5: Master (P3.1 P4.16), MCU (6 pins), CAN (6 pins), Demux (7 pins)
GND: Master (P3.2 P4.15), MCU (17 pins), CAN (11 pins), Demux (34 pins)
CAN_CS: MCU (U7.43 Z2.4), CAN (U1.13)
CAN_INT: MCU (U7.40 Z2.5), CAN (U1.4)
CAN_INT0: MCU (U7.42), CAN (U1.9)
CAN_INT1: MCU (U7.41 Z2.6), CAN (U1.8)
CAN_N: Master (P3.4), CAN (D1.1 R3.1 TP4.1 U2.6)
CAN_P: Master (P3.3), CAN (D1.2 R1.2 TP1.1 U2.7)
CAN_RX: MCU (Z2.8), CAN (DS2.2 TP3.1 U1.2 U2.4)
CAN_TX: MCU (Z2.7), CAN (DS1.2 TP2.1 U1.1 U2.1)
MCU_CLK: MCU (P2.3 U7.3 Z2.3), CAN (U1.10)
MCU_MISO: MCU (P2.1 U7.2 Z2.2), CAN (U1.12)
MCU_MOSI: MCU (P2.4 U7.1 Z2.1), CAN (U1.11)
MUX_SHIFT_CLK: MCU (TP12.1 U7.26 Z1.4), Demux (U5.11)
MUX_SHIFT_DATA: MCU (TP10.1 U7.24 Z1.2), Demux (U5.14)
MUX_SHIFT_LATCH: MCU (TP11.1 U7.25 Z1.3), Demux (U5.12)
MUX_SHIFT_RESET: MCU (TP9.1 U7.23 Z1.1), Demux (U5.10)
NetP3_5: Master (P3.5), Demux (R12.1)
NetP3_6: Master (P3.6), Demux (R13.1)
NetP3_7: Master (P3.7), Demux (R14.1)
NetP3_8: Master (P3.8), Demux (R15.1)
NetP3_9: Master (P3.9), Demux (R16.1)
NetP3_10: Master (P3.10), Demux (R17.1)
NetP3_11: Master (P3.11), Demux (R6.1)
NetP3_12: Master (P3.12), Demux (R7.1)
NetP3_13: Master (P3.13), Demux (R8.1)
NetP3_14: Master (P3.14), Demux (R9.1)
NetP3_15: Master (P3.15), Demux (R10.1)
NetP3_16: Master (P3.16), Demux (R11.1)
NetP4_1: Master (P4.1), Demux (R32.1)
NetP4_2: Master (P4.2), Demux (R31.1)
NetP4_3: Master (P4.3), Demux (R18.1)
NetP4_4: Master (P4.4), Demux (R27.1)
NetP4_5: Master (P4.5), Demux (R26.1)
NetP4_6: Master (P4.6), Demux (R25.1)
NetP4_7: Master (P4.7), Demux (R24.1)
NetP4_8: Master (P4.8), Demux (R23.1)
NetP4_9: Master (P4.9), Demux (R22.1)
NetP4_10: Master (P4.10), Demux (R21.1)
NetP4_11: Master (P4.11), Demux (R20.1)
NetP4_12: Master (P4.12), Demux (R19.1)
SHDN_SENSE_A: MCU (U7.37), Demux (TP5.1 U3.1 U3.2)
SHDN_SENSE_B: MCU (U7.36), Demux (TP8.1 U3.6 U3.7)